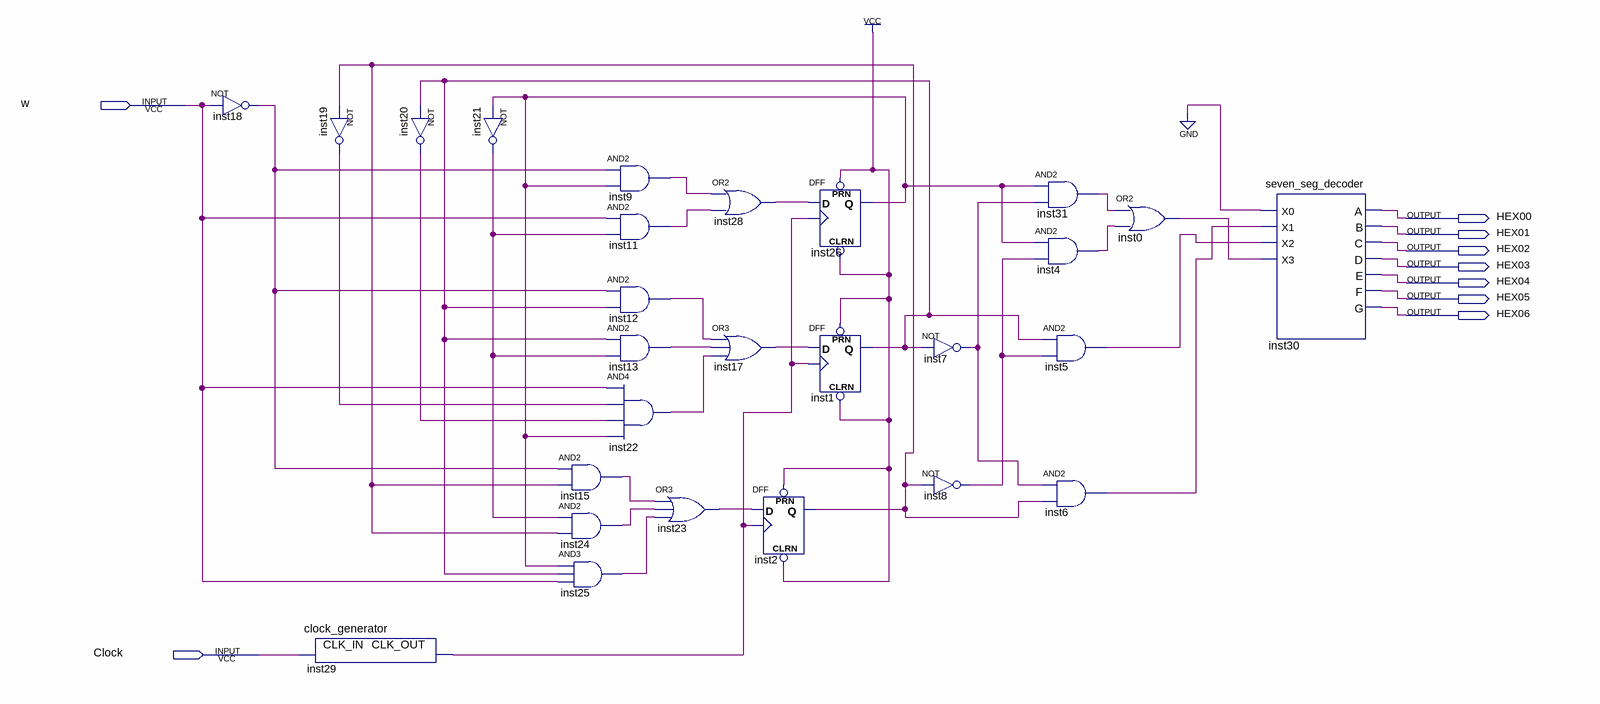
[diagram p0: schematic sheet]
// Quartus schematic lab11step1.bdf as structural Verilog: 27 symbols, 9 pins
module lab11step1 (
  input  w,
  input  Clock,
  output HEX00,
  output HEX01,
  output HEX02,
  output HEX03,
  output HEX04,
  output HEX05,
  output HEX06
);

  wire inst0_out, inst1_q, inst2_q, inst4_out, inst5_out, inst6_out, inst7_out, inst8_out, inst9_out,
       inst11_out, inst12_out, inst13_out, inst15_out, inst17_out, inst18_out, inst19_out, inst20_out,
       inst21_out, inst22_out, inst23_out, inst24_out, inst25_out, inst26_q, inst28_out, inst29_clk_out,
       inst31_out;

  not inst18 (inst18_out, w);
  clock_generator inst29 (.CLK_IN(Clock), .CLK_OUT(inst29_clk_out));
  not inst19 (inst19_out, inst2_q);
  not inst20 (inst20_out, inst1_q);
  not inst21 (inst21_out, inst26_q);
  and inst15 (inst15_out, inst18_out, inst2_q);
  and inst24 (inst24_out, inst21_out, inst2_q);
  and inst25 (inst25_out, inst26_q, inst1_q, w);
  and inst9 (inst9_out, inst18_out, inst26_q);
  and inst11 (inst11_out, w, inst21_out);
  and inst12 (inst12_out, inst18_out, inst1_q);
  and inst13 (inst13_out, inst1_q, inst21_out);
  and inst22 (inst22_out, w, inst19_out, inst20_out, inst26_q);
  or inst23 (inst23_out, inst15_out, inst24_out, inst25_out);
  or inst28 (inst28_out, inst9_out, inst11_out);
  or inst17 (inst17_out, inst12_out, inst13_out, inst22_out);
  DFF inst2 (.CLRN(1'b1), .CLK(inst29_clk_out), .D(inst23_out), .PRN(1'b1), .Q(inst2_q));
  DFF inst26 (.CLRN(1'b1), .CLK(inst29_clk_out), .D(inst28_out), .PRN(1'b1), .Q(inst26_q));
  DFF inst1 (.CLRN(1'b1), .CLK(inst29_clk_out), .D(inst17_out), .PRN(1'b1), .Q(inst1_q));
  not inst7 (inst7_out, inst1_q);
  not inst8 (inst8_out, inst2_q);
  and inst31 (inst31_out, inst26_q, inst7_out);
  and inst4 (inst4_out, inst26_q, inst8_out);
  and inst5 (inst5_out, inst1_q, inst8_out);
  and inst6 (inst6_out, inst7_out, inst2_q);
  or inst0 (inst0_out, inst31_out, inst4_out);
  seven_seg_decoder inst30 (
    .X0(1'b0), .X1(inst6_out), .X2(inst5_out), .X3(inst0_out), .A(HEX00), .B(HEX01), .C(HEX02), .D(HEX03),
    .E(HEX04), .F(HEX05), .G(HEX06));
endmodule
